# EasyEDA Pro project ProDocument_esp32 brewpiless_2024-01-04.epro

# Schematic esp32 brewpiless

## Sheets
1 ESP32
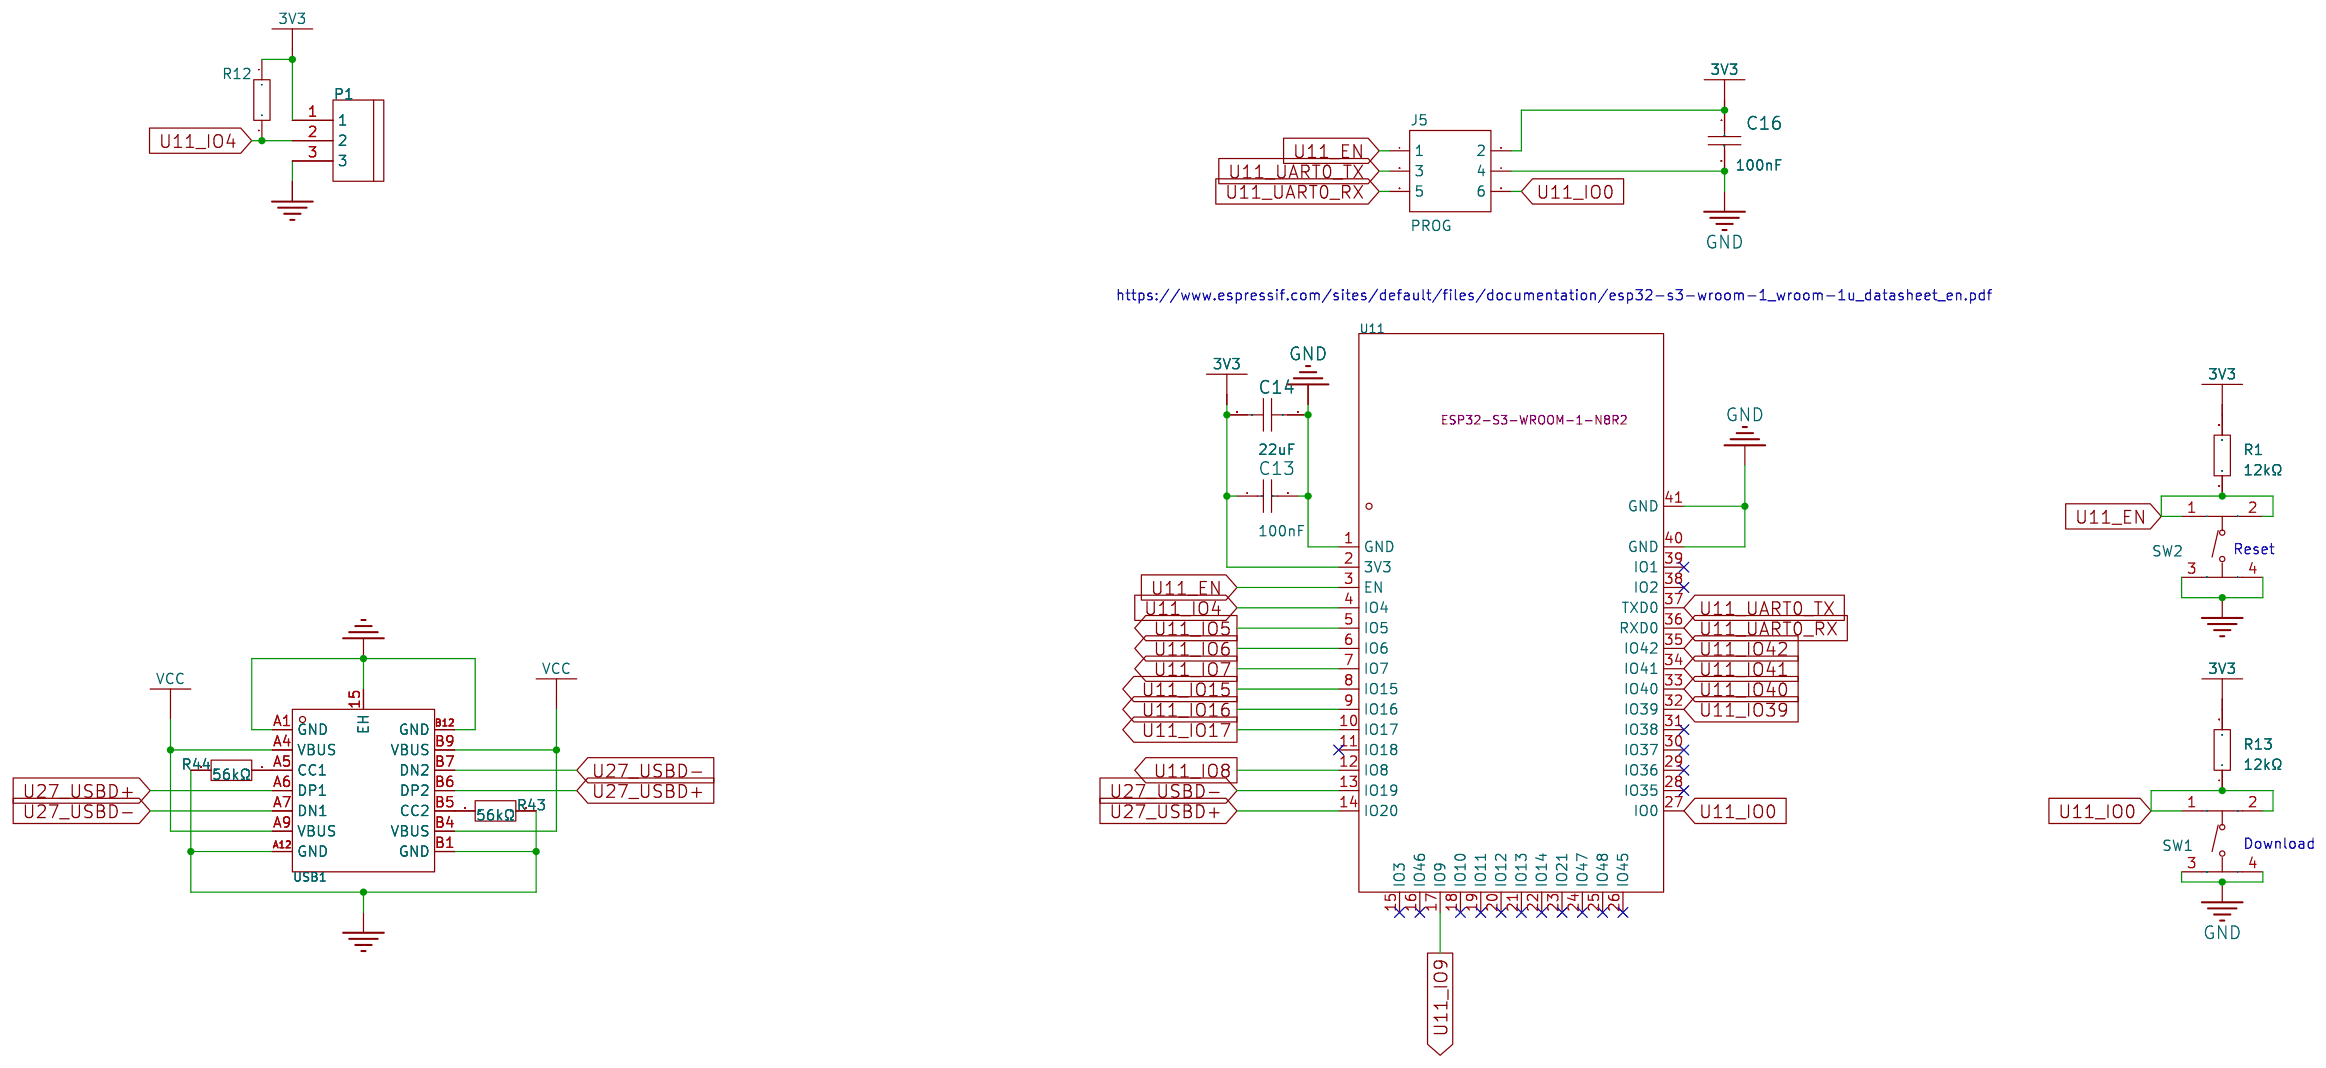
[diagram p0: ESP32]
2 Mains: Create Date: 2023-09-11; Page Name: Mains; Project Name: ESP8266 Brewpiless c6; Schematic Name: ESP32 Brewpiless; Update Date: 2024-01-02; Company: EasyEDA.com; Drawed: EasyEDAPro; Page Size: A4; Part Number: JLCPCB-002; Reviewed: EasyEDAPro; Version: V0.1
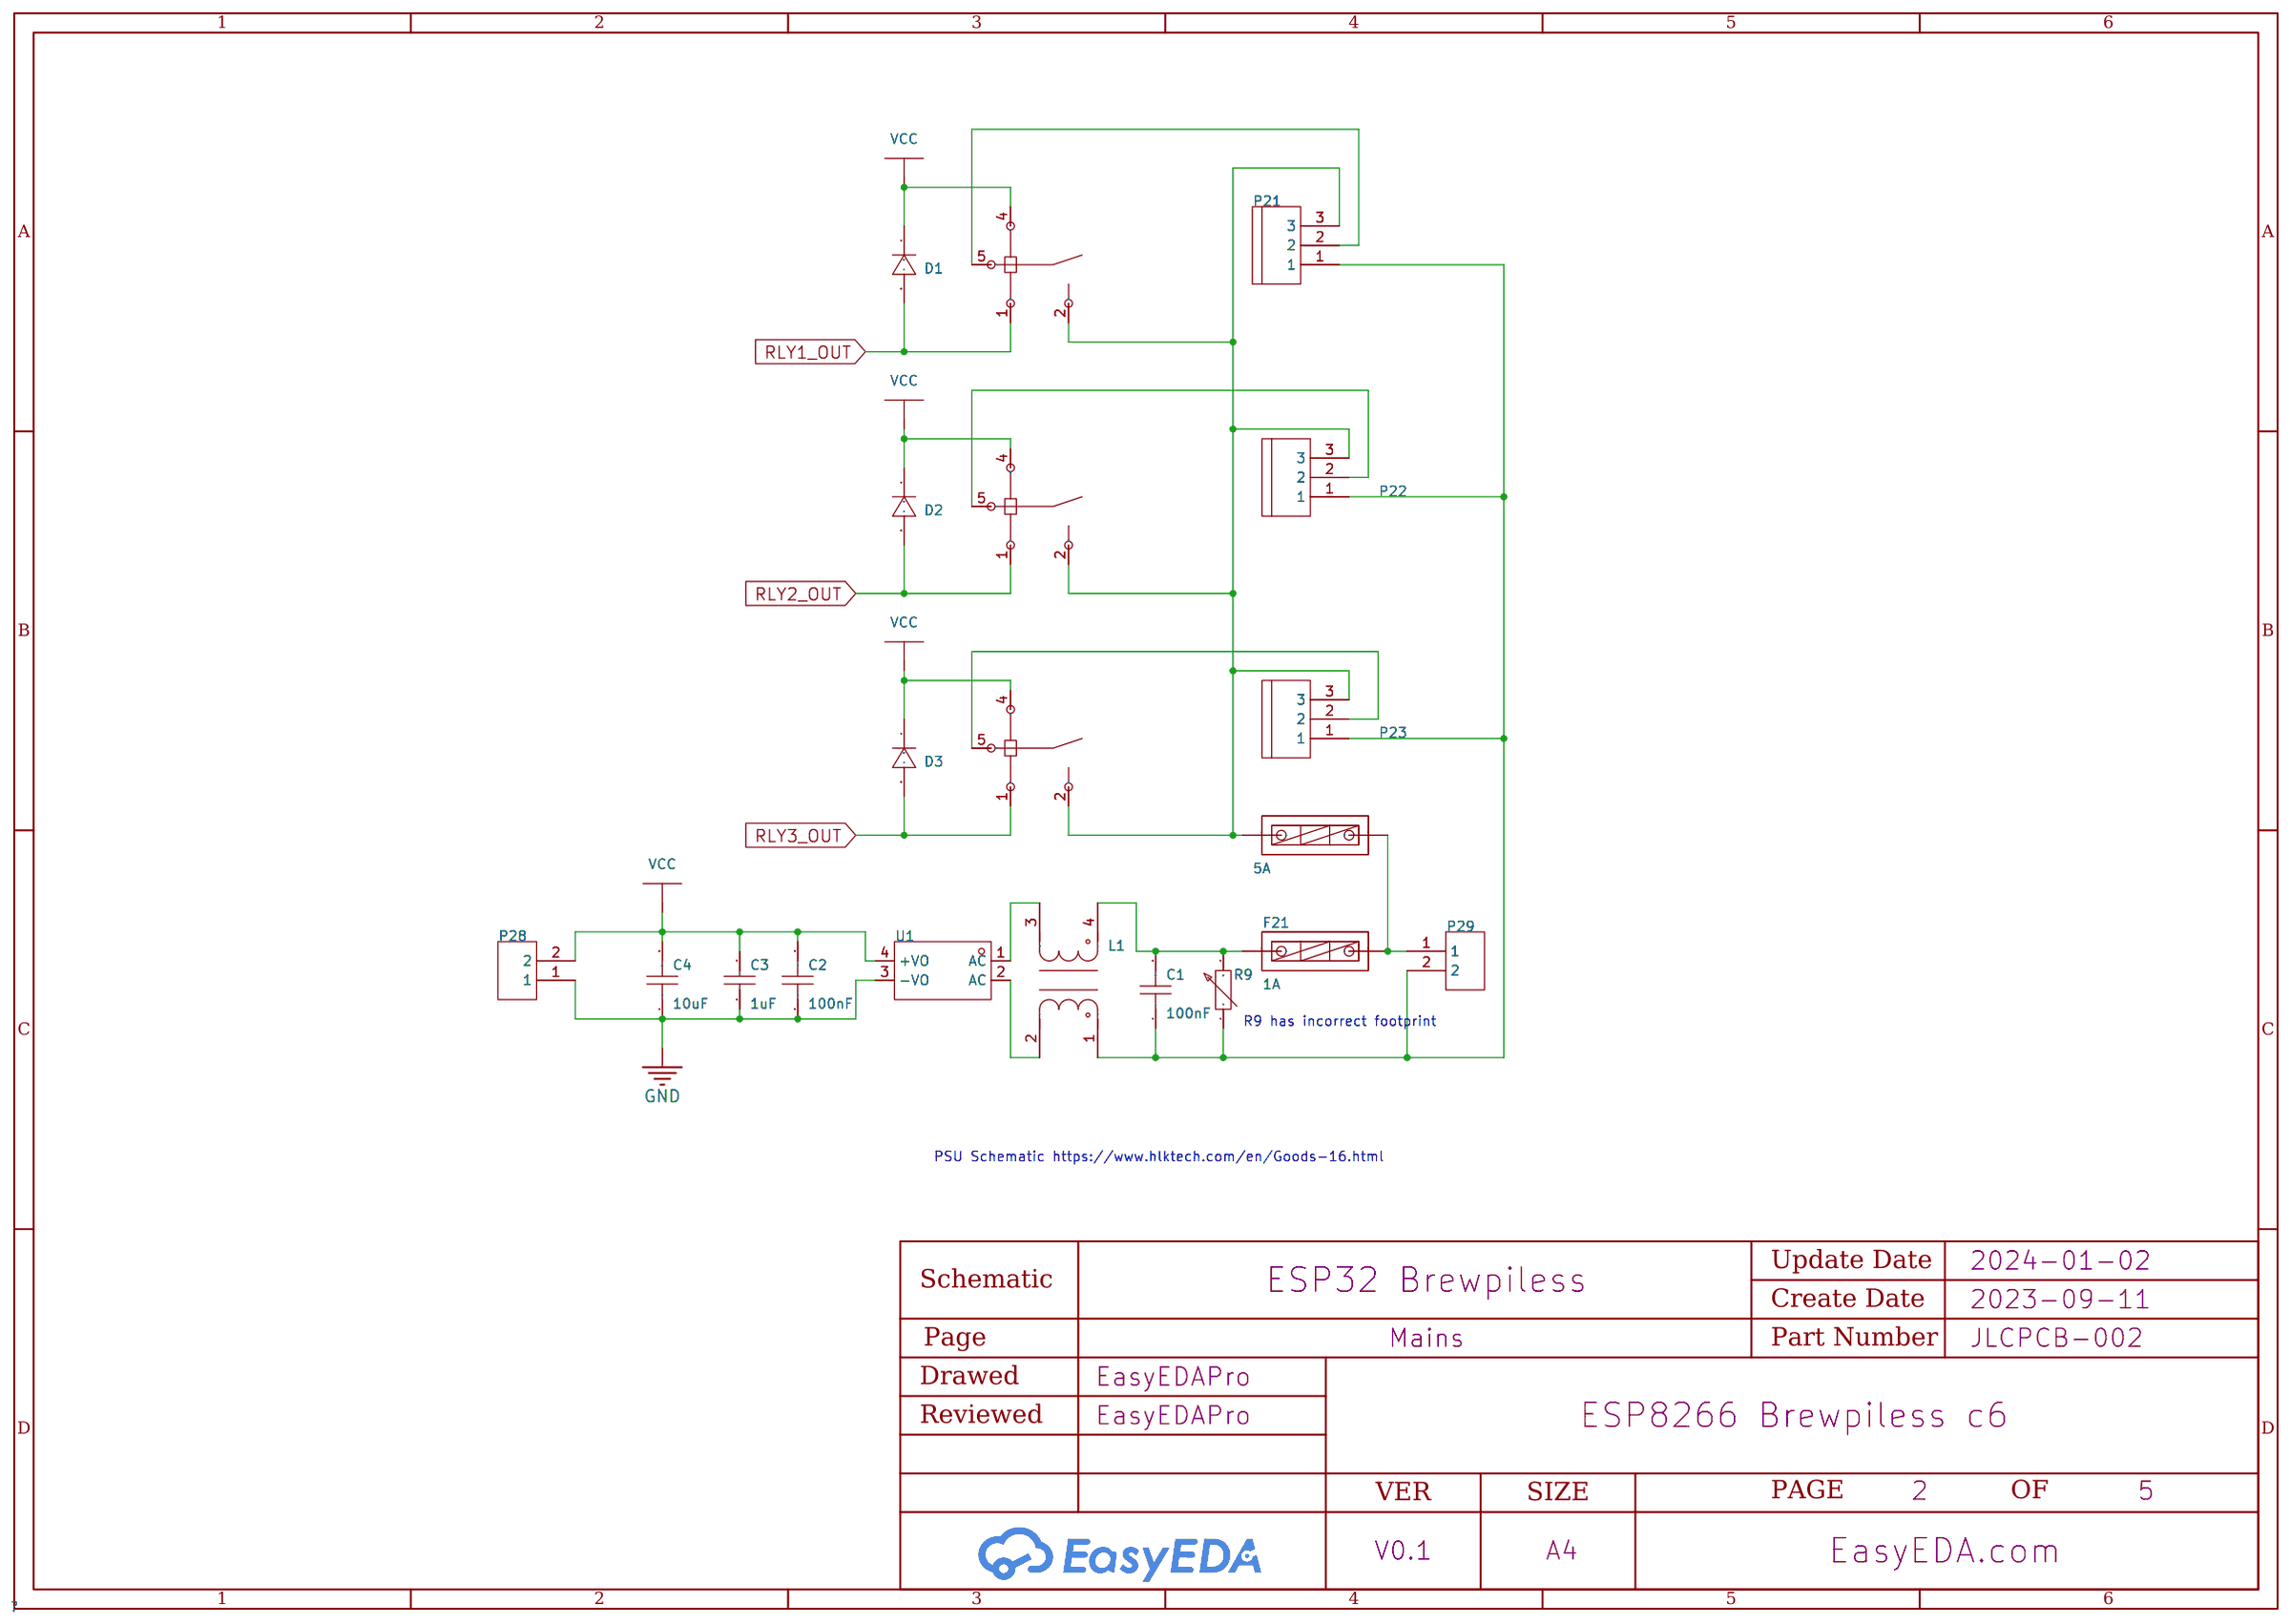
[diagram p1: Mains]
3 LevelShifter: Create Date: 2024-01-03; Page Name: LevelShifter; Project Name: ESP32-S3 Brewpiless V1 Rev 1; Schematic Name: esp32 brewpiless; Update Date: 2024-01-03; Company: EasyEDA.com; Drawed: EasyEDAPro; Page Size: A4; Part Number: JLCPCB-002; Reviewed: EasyEDAPro; Version: V0.1
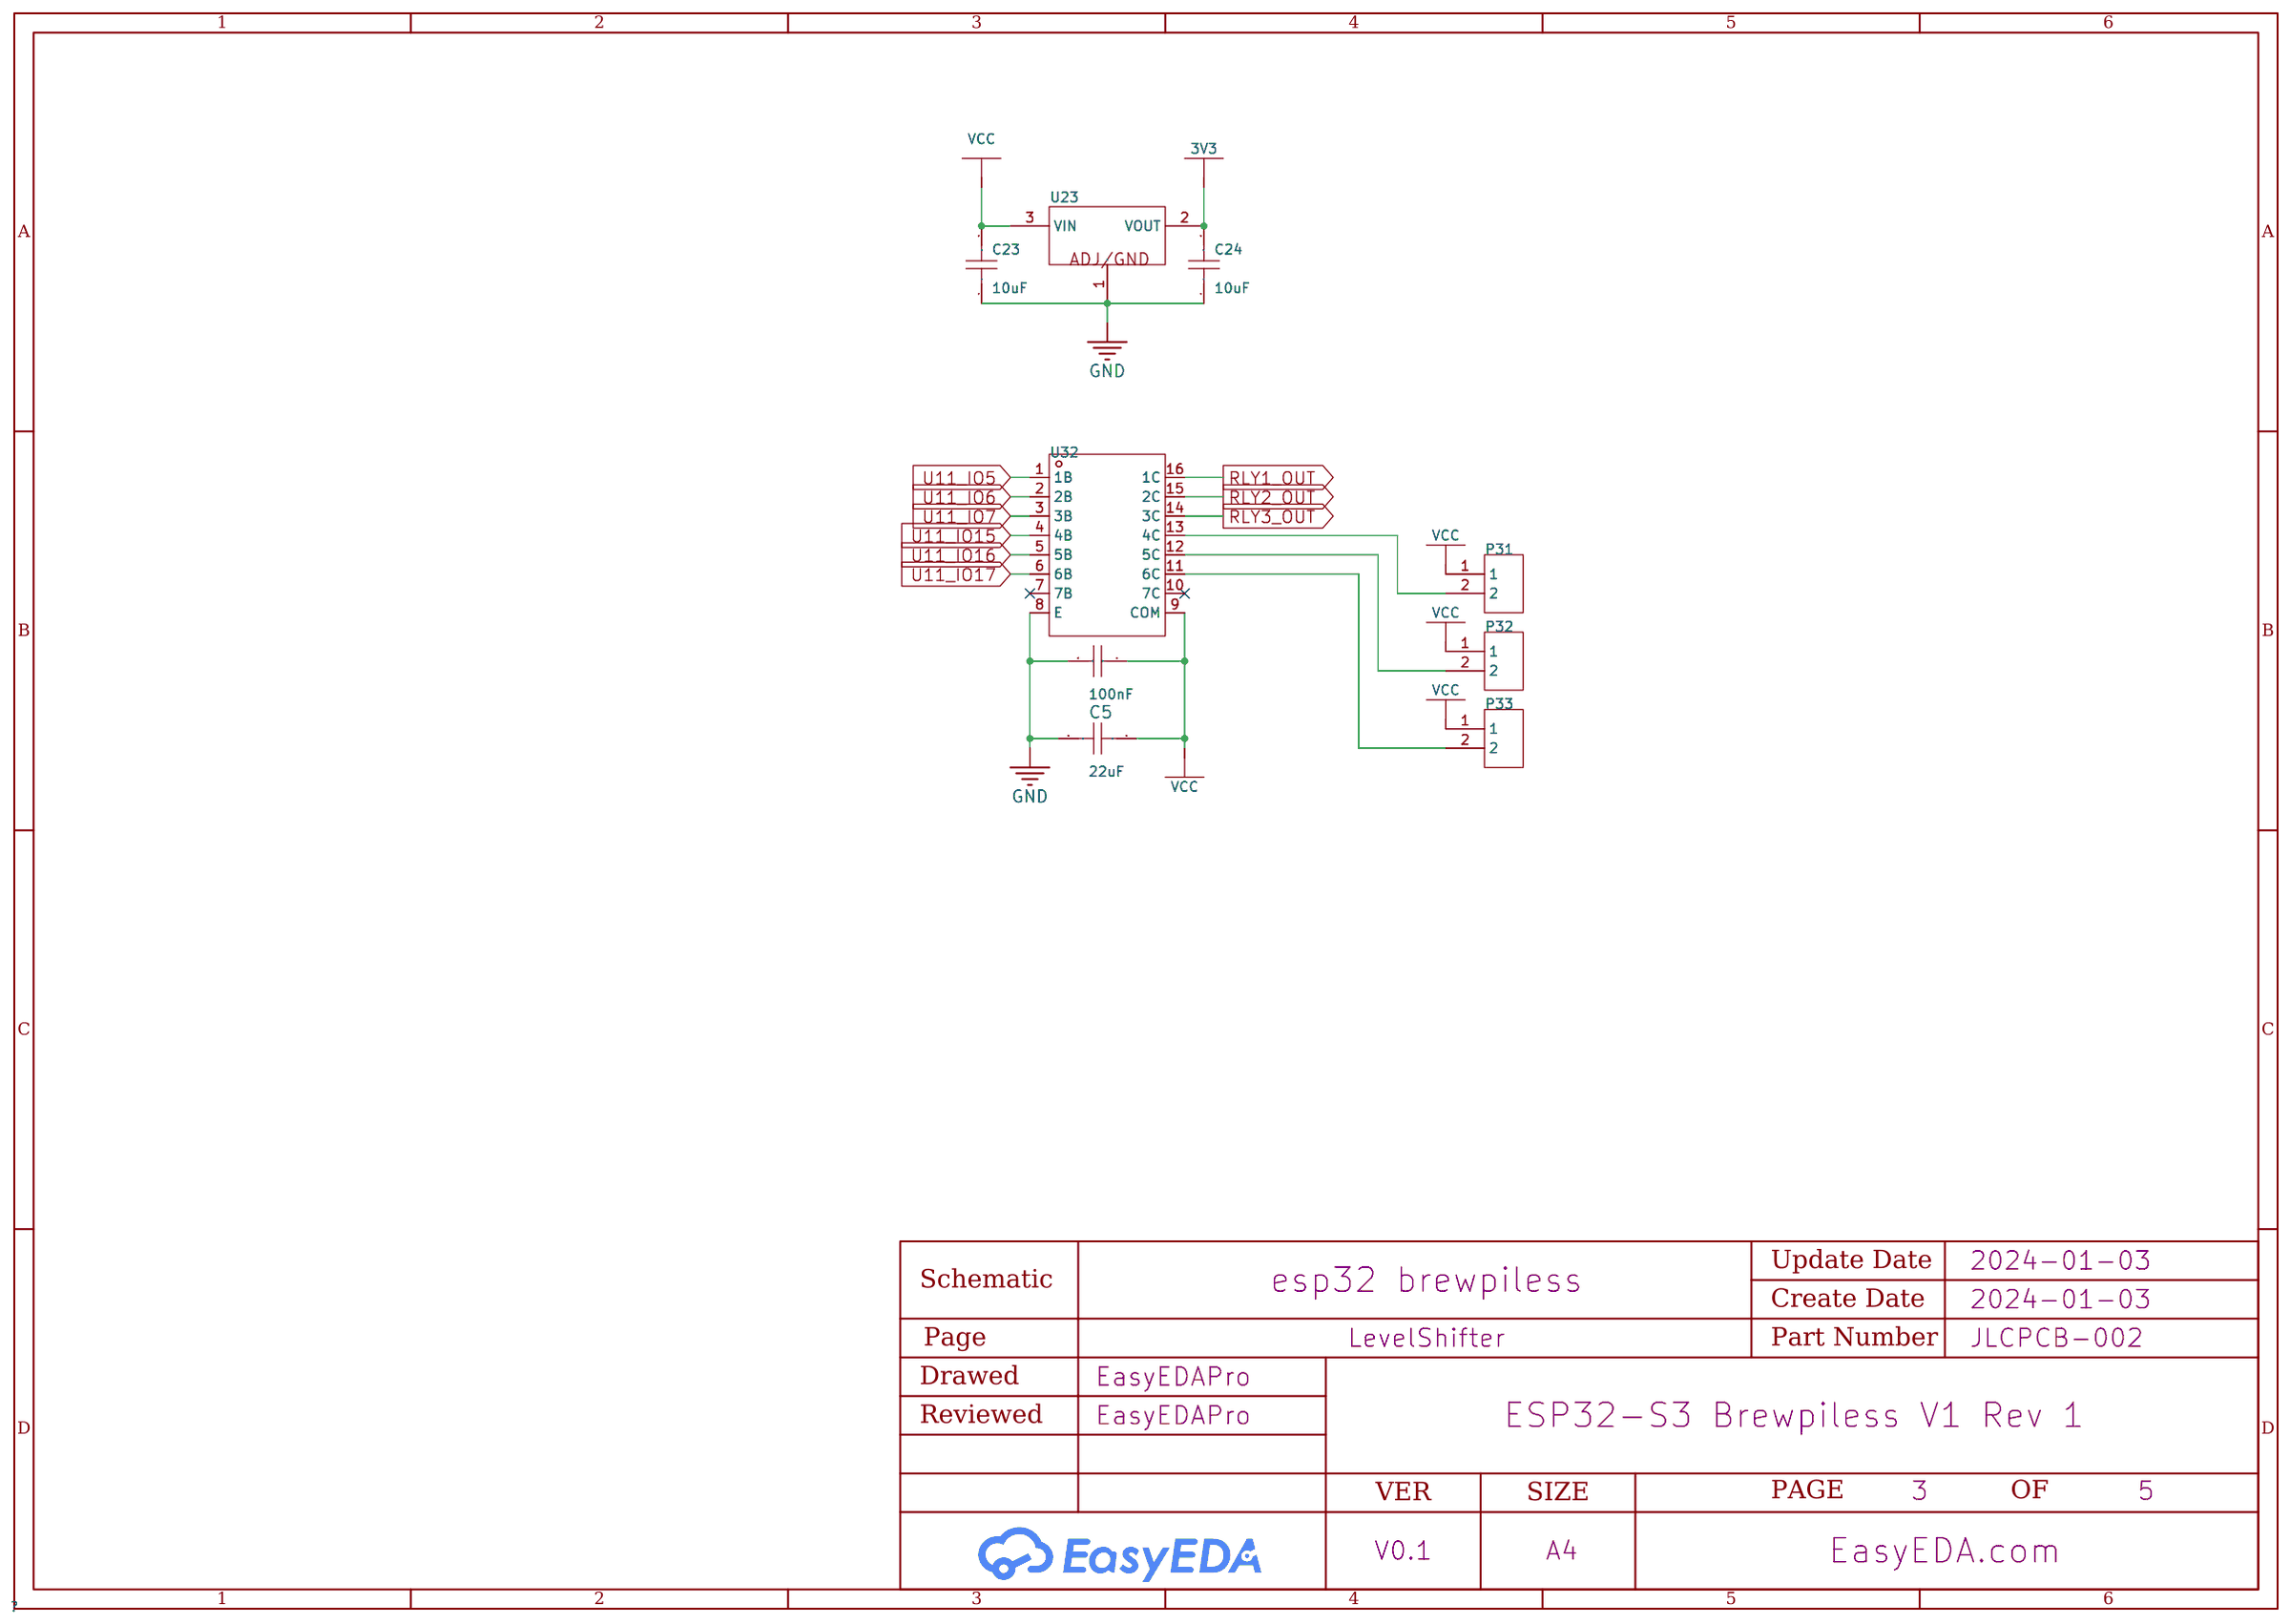
[diagram p2: LevelShifter]
4 RTD: Create Date: 2024-01-01; Page Name: RTD; Project Name: ESP8266 Brewpiless c6; Schematic Name: ESP32 Brewpiless; Update Date: 2024-01-02; Company: EasyEDA.com; Drawed: EasyEDA Pro; Page Size: A4; Part Number: JLCPCB-002; Reviewed: EasyEDA Pro; Version: V0.1
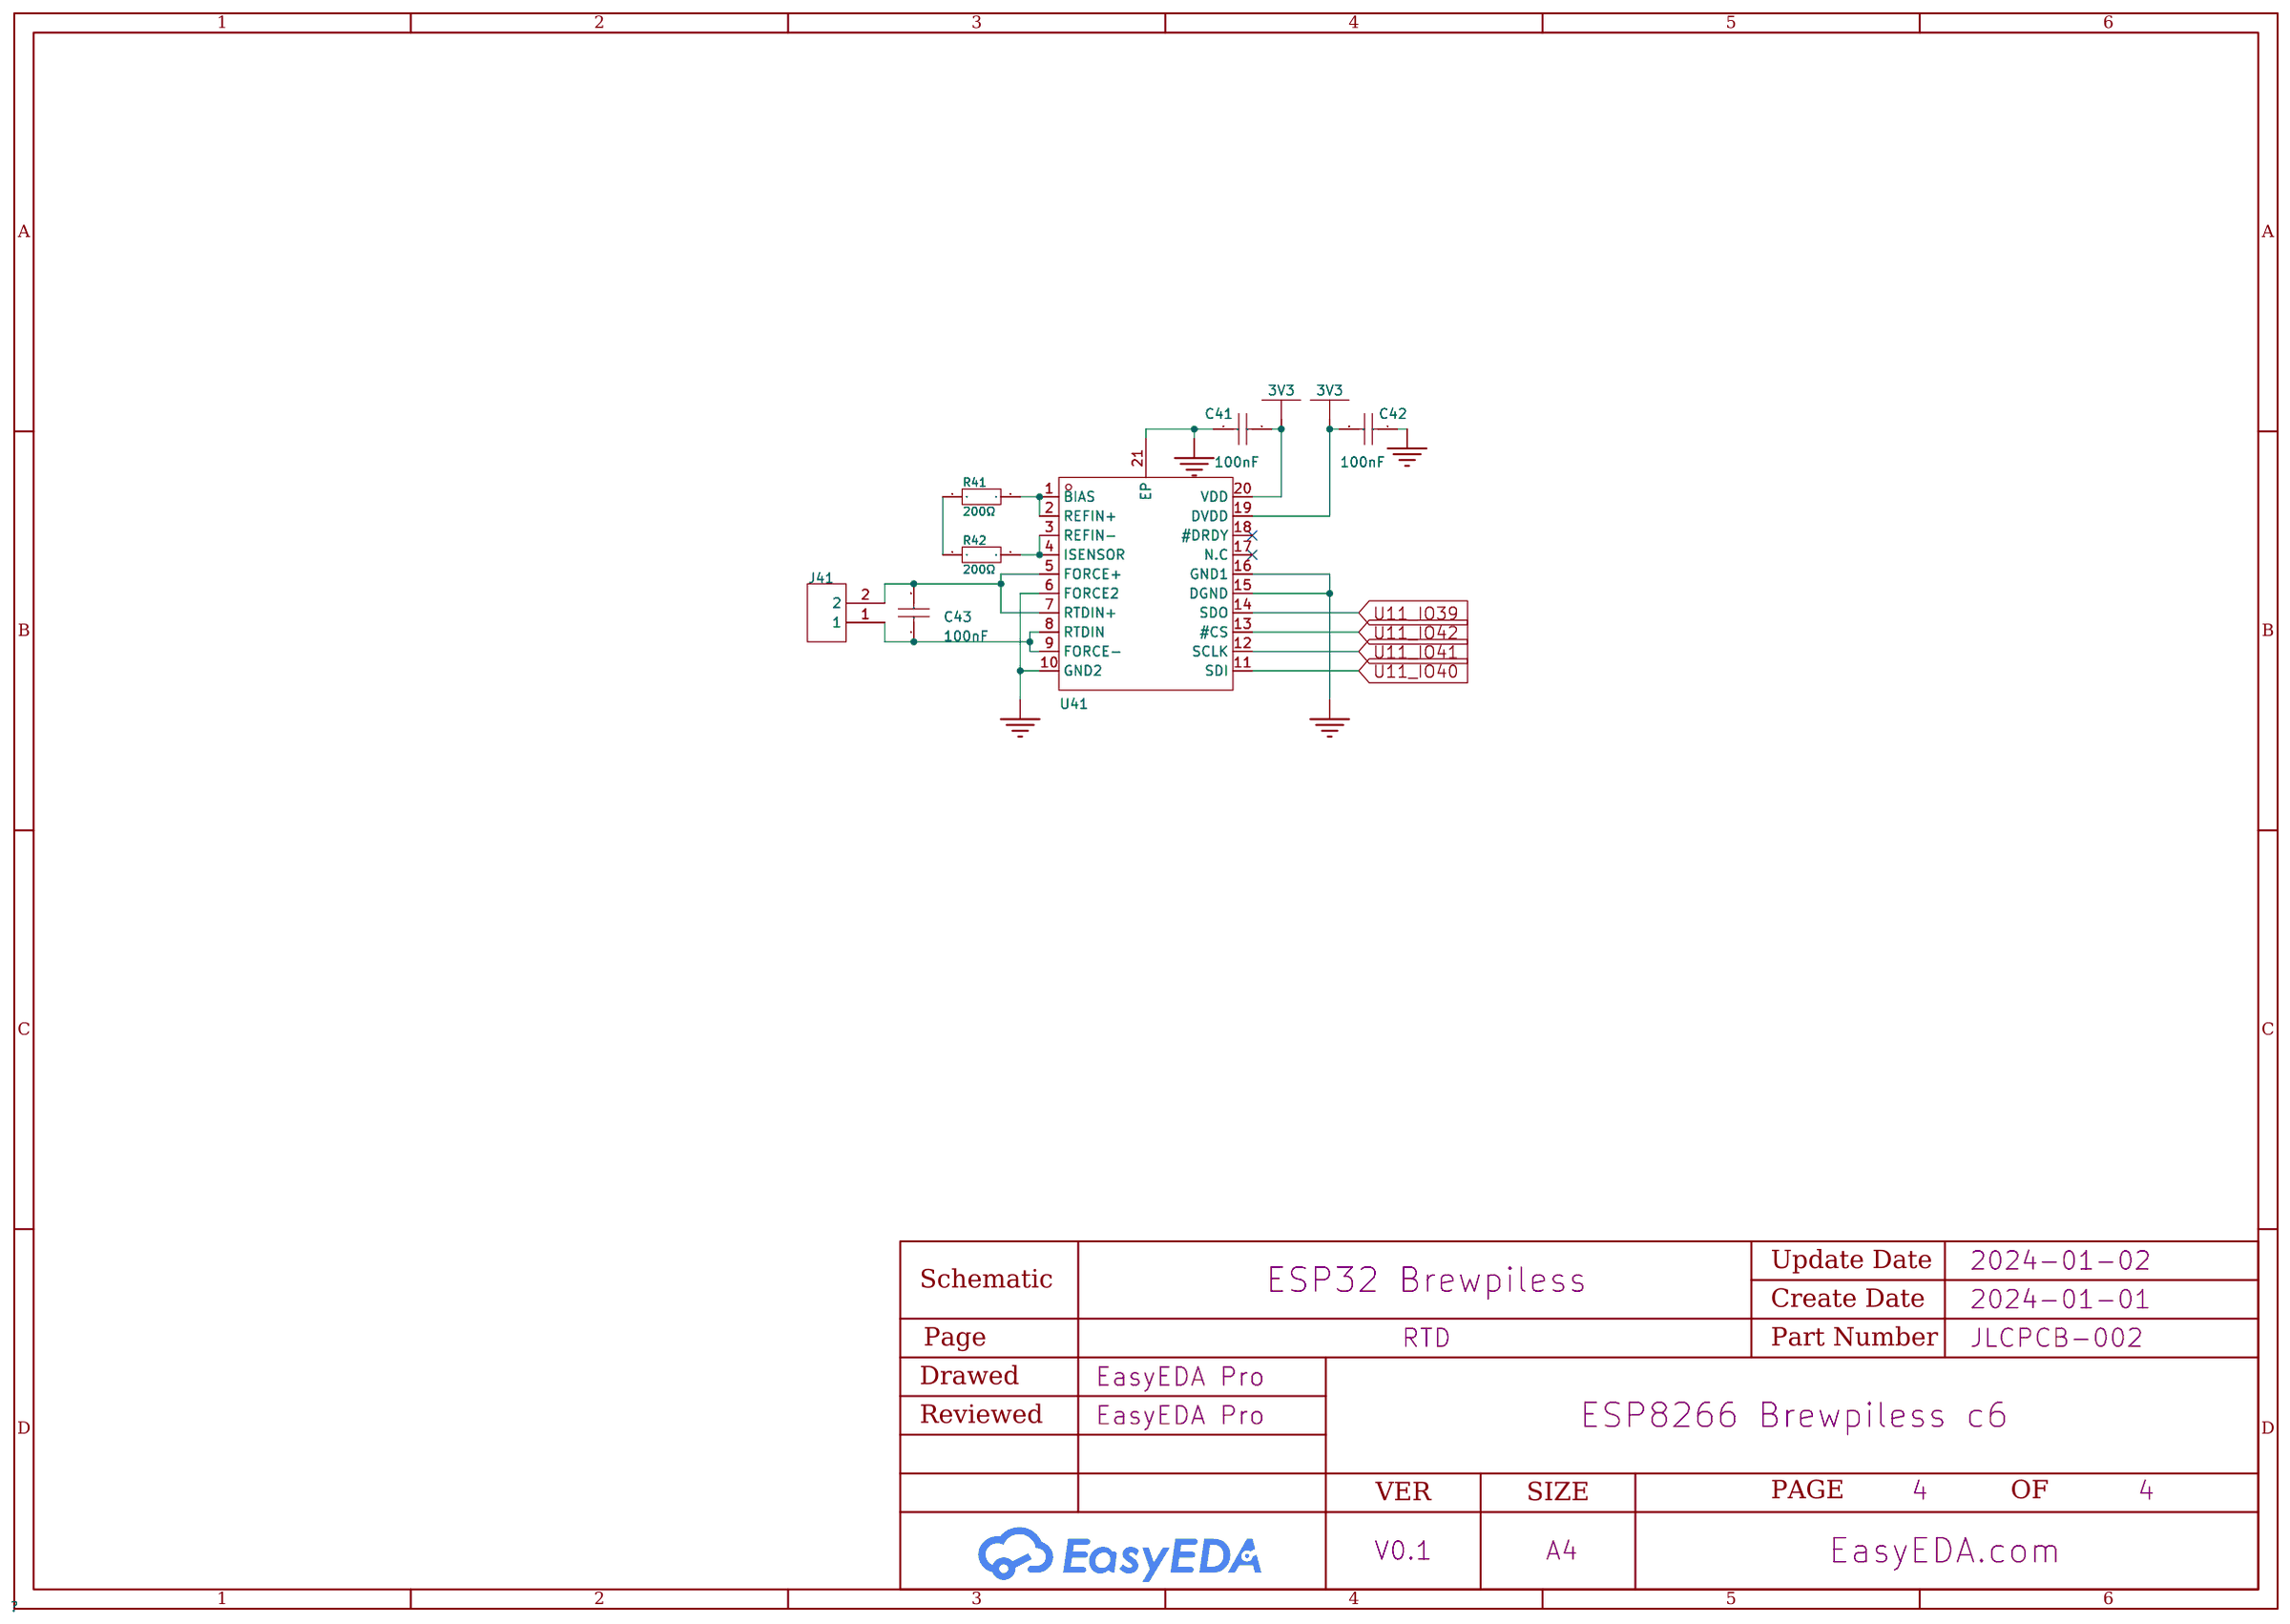
[diagram p3: RTD]
5 ATEC: Create Date: 2024-01-02; Page Name: ATEC; Project Name: ESP8266 Brewpiless c6; Schematic Name: ESP32 Brewpiless; Update Date: 2024-01-02; Company: EasyEDA.com; Drawed: EasyEDA Pro; Page Size: A4; Part Number: JLCPCB-002; Reviewed: EasyEDA Pro; Version: V0.1
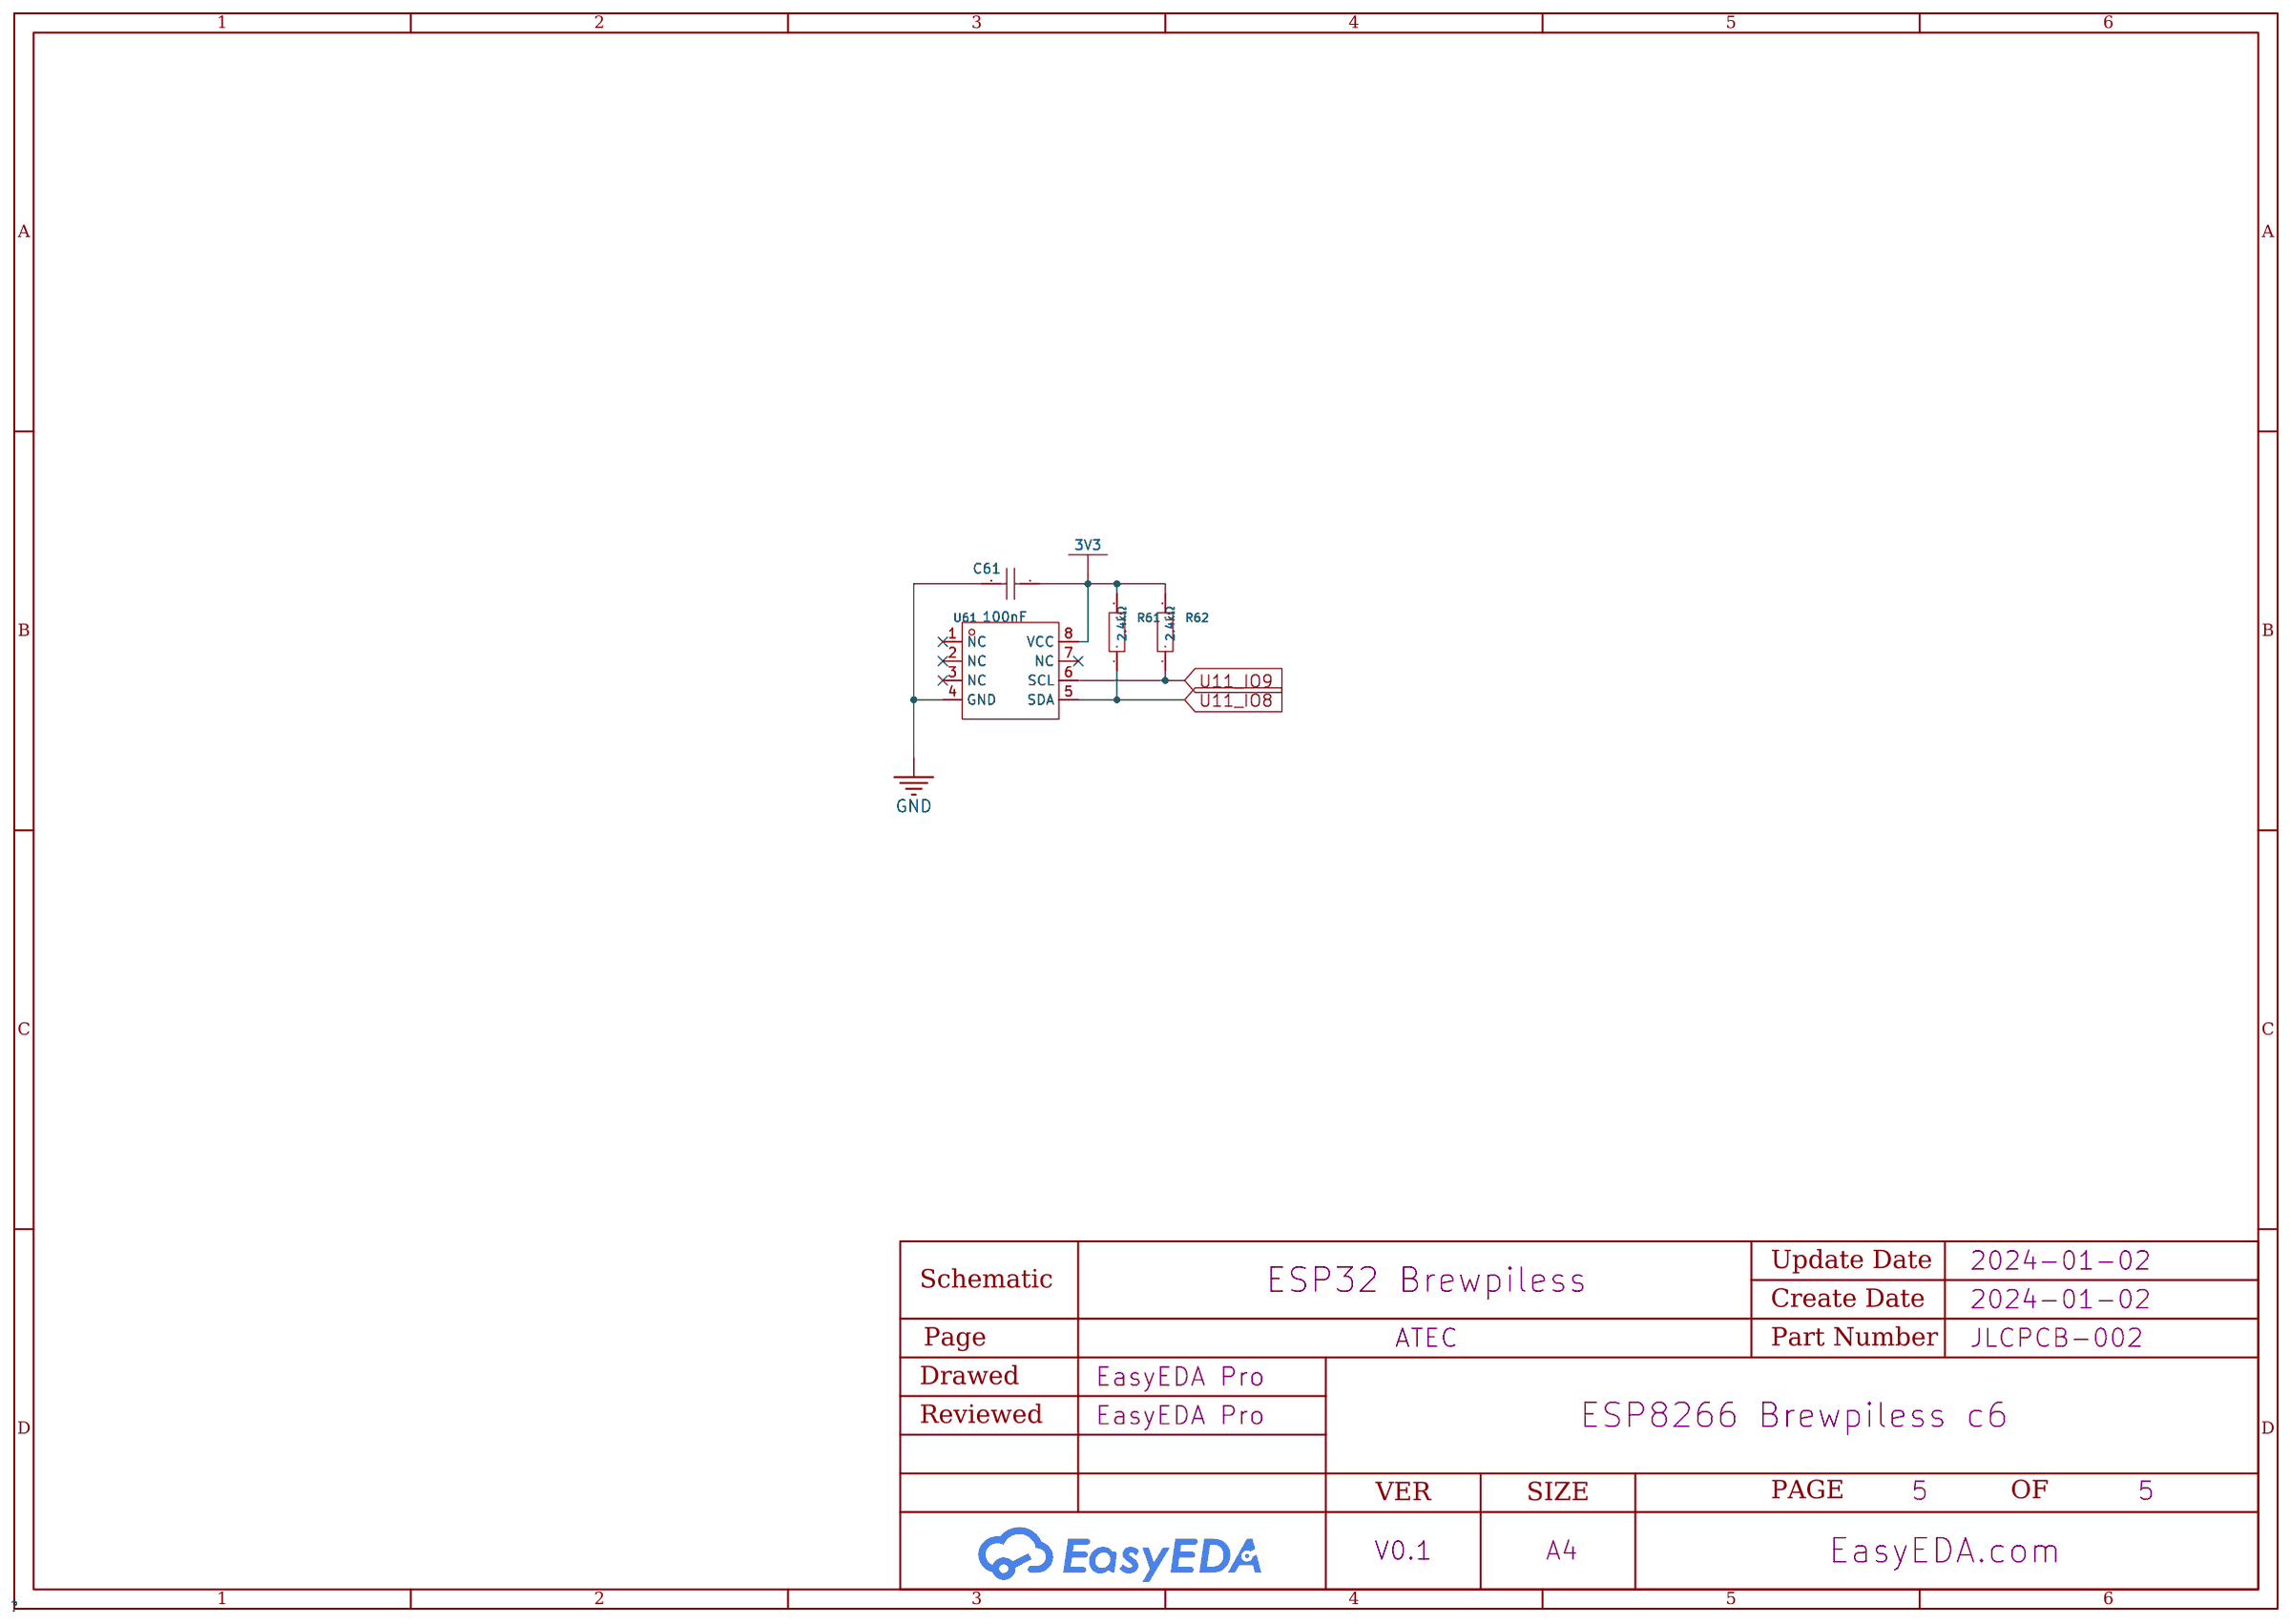
[diagram p4: ATEC]

## Parts
sheet ATEC
C61  100nF  [C0805]
R61  2.4kΩ  [R0805]
R62  2.4kΩ  [R0805]
U61  ATECC608A-SSHDA-T  [SOIC-8_L4.9-W3.9-P1.27-LS6.0-BL]
sheet ESP32
C13  100nF  [C0805]
C14  22uF  [C0805]
C16  100nF  [C0805]
J5  PROG  [IDC-TH_6P-P2.54_C11214]
P1  WJ500V-5.08-3P  [CONN-TH_3P-P5.00_WJ500V-5.08-3P]
R1  12kΩ  [R0805]
R12  4.7kΩ  [R0805]
R13  12kΩ  [R0805]
R43  56kΩ  [R0805]
R44  56kΩ  [R0805]
SW1  TS-1187A-B-A-B  [SW-SMD_4P-L5.1-W5.1-P3.70-LS6.5-TL-2]
SW2  TS-1187A-B-A-B  [SW-SMD_4P-L5.1-W5.1-P3.70-LS6.5-TL-2]
U11  2.4GHz  [WIRELM-SMD_ESP32-S3-WROOM-1]
USB1  TYPE-C 14P LTH10.0  [TYPE-C-SMD_918-468K2029Y50001]
sheet LevelShifter
C5  22uF  [C0805]
C22  100nF  [C0805]
C23  10uF  [C0805]
C24  10uF  [C0805]
P31  WJ500V-5.08-2P  [CONN-TH_2P-P5.00_WJ500V-5.08-2P]
P32  WJ500V-5.08-2P  [CONN-TH_2P-P5.00_WJ500V-5.08-2P]
P33  WJ500V-5.08-2P  [CONN-TH_2P-P5.00_WJ500V-5.08-2P]
U23  -  [TO-252-2_L6.6-W6.1-P4.57-LS9.9-TL-CW]
U32  -  [SOIC-16_L9.9-W3.9-P1.27-LS6.0-BL]
sheet Mains
C1  100nF  [CAP-TH_L12.0-W5.5-P10.00-D0.6]
C2  100nF  [CAP-TH_L12.0-W5.5-P10.00-D0.6]
C3  1uF  [C0805]
C4  10uF  [C0805]
D1  SM4007PL  [SOD-123F_L2.8-W1.8-LS3.7-RD]
D2  SM4007PL  [SOD-123F_L2.8-W1.8-LS3.7-RD]
D3  SM4007PL  [SOD-123F_L2.8-W1.8-LS3.7-RD]
F21  -  [FUSE-TH_5X20RHOSFUSECLIP-SEAT]
F22  5A  [FUSE-TH_5X20RHOSFUSECLIP-SEAT]
F210  1A  [FUSE-TH_5X20RHOSFUSECLIP-SEAT]
F220  10A  [FUSE-TH_5X20RHOSFUSECLIP-SEAT]
K1  -  [RELAY-TH_973-XXVDC-SL-A]
K2  -  [RELAY-TH_973-XXVDC-SL-A]
K3  -  [RELAY-TH_973-XXVDC-SL-A]
L1  -  [FILTER-TH_UU10.5Y-10MH]
P21  WJ500V-5.08-3P  [CONN-TH_3P-P5.00_WJ500V-5.08-3P]
P22  WJ500V-5.08-3P  [CONN-TH_3P-P5.00_WJ500V-5.08-3P]
P23  WJ500V-5.08-3P  [CONN-TH_3P-P5.00_WJ500V-5.08-3P]
P28  WJ500V-5.08-2P  [CONN-TH_2P-P5.00_WJ500V-5.08-2P]
P29  WJ500V-5.08-2P  [CONN-TH_2P-P5.00_WJ500V-5.08-2P]
R9  10D561K  [RES-TH_L13.0-W6.0-P7.50-D0.9-S6.00]
U1  -  [PWRM-TH_HLK-5M05]
sheet RTD
C41  100nF  [C0805]
C42  100nF  [C0805]
C43  100nF  [C0805]
J41  WJ500V-5.08-2P  [CONN-TH_2P-P5.00_WJ500V-5.08-2P]
R41  200Ω  [R0805]
R42  200Ω  [R0805]
U41  MAX31865ATP+T  [QFN-20_L5.0-W5.0-P0.65-BL-EP]

## Library data of the parts
C41-C43 C61 = CC0805KRX7R9BB104: Capacitance: Tolerance:±10% Tolerance:±10% Voltage Rated: Temperature Coefficient:; LCSC Part Name: 100nF ±10% 50V; Supplier Part: C49678; Manufacturer: YAGEO(国巨); Supplier Footprint: 0805; JLCPCB Part Class: Basic Part; Datasheet: https://atta.szlcsc.com/upload/public/pdf/source/20180224/C181747_15194369449651363981.pdf; Supplier: LCSC; Tolerance: ±10%; Voltage Rated: 450V; Operating Temperature: -40℃~+105℃
R61 R62 = 0805W8F2401T5E: Resistance:2400Ω Tolerance:±1% Tolerance:±1% Power(Watts): Overload Voltage (Max): Temperature Coefficient:±100ppm/℃ Temperature Coefficient:±100ppm/℃ Type:Thick Film Resistors Operating Temperature Range:-55℃~+155℃ Operating Temperature Range:-55℃~+155℃; LCSC Part Name: 2.4kΩ ±1% 125mW 厚膜电阻; Supplier Part: C17526; Manufacturer: UNI-ROYAL(厚声); Supplier Footprint: 0805; JLCPCB Part Class: Basic Part; Datasheet: https://atta.szlcsc.com/upload/public/pdf/source/20200306/C422600_1E6D84923E4A46A82E41ADD87F860B5C.pdf; Supplier: LCSC; Tolerance: ±1%; Temperature Coefficient: ±100ppm/℃; Type: Thick Film Resistors; Operating Temperature Range: -55℃~+155℃
U61 = ATECC608A-SSHDA-T_C616024: Supplier Part: C616024; Manufacturer: MICROCHIP(美国微芯); Supplier Footprint: SOP-8; JLCPCB Part Class: Extended Part; Datasheet: https://atta.szlcsc.com/upload/public/pdf/source/20211006/C2650407_D58AC76DEF233DF217701720610C6837.pdf; Supplier: LCSC
C13 C16 C22 = CC0805KRX7R9BB104: Capacitance: Tolerance:±10% Tolerance:±10% Voltage Rated: Temperature Coefficient:; LCSC Part Name: 100nF ±10% 50V; Supplier Part: C49678; Manufacturer: YAGEO(国巨); Supplier Footprint: 0805; JLCPCB Part Class: Basic Part; Datasheet: https://atta.szlcsc.com/upload/public/pdf/source/20180224/C181747_15194369449651363981.pdf; Supplier: LCSC; Tolerance: ±10%; Voltage Rated: 50V; Temperature Coefficient: X7R
C5 C14 = CL21A226MAQNNNE_C45783: Capacitance: Tolerance:±20% Tolerance:±20% Voltage Rated: Temperature Coefficient:; LCSC Part Name: 22uF ±20% 25V; Supplier Part: C45783; Manufacturer: SAMSUNG(三星); Manufacturer Part: CL21A226MAQNNNE; Supplier Footprint: 0805; JLCPCB Part Class: Basic Part; Datasheet: https://atta.szlcsc.com/upload/public/pdf/source/20160218/1457707763339.pdf; Supplier: LCSC; Tolerance: ±20%; Voltage Rated: 50V; Temperature Coefficient: Y5V
J5 = 2.54-2*3P简牛: Connector Type:简牛座 Pitch:2.54mm Number of Rows:2 Row Spacing:2.54mm Holder Type:直插 Contact Material:黄铜 Contact Plating:金; LCSC Part Name: 2.54mm 排数:2 2*3P; Supplier Part: C11214; Manufacturer: BOOMELE(博穆精密); Supplier Footprint: 插件,P=2.54mm; JLCPCB Part Class: Extended Part; Datasheet: https://atta.szlcsc.com/upload/public/pdf/source/20140331/1457707037652.pdf; Supplier: LCSC; Connector Type: 简牛座; Pitch: 2.54mm; Number of Rows: 2; Row Spacing: 2.54mm; Holder Type: 直插; Contact Material: 黄铜; Contact Plating: 金
P1 = WJ500V-5.08-3P: Pitch:5.08mm Structure:1x3P Number of Rows:1 Number of PINs Per Row:3 Mounting Style:Straight Current Rating (Max):18A Voltage Rating (Max):250V Wire Gauge - AWG:14~30 Wire Gauge - AWG:14~30 Wire Gauge - mm2:2.5 Wire Gauge - mm2:2.5 Operating Temperature; LCSC Part Name: 5.08mm 1x3P 排数:1 每排P数:3 直插 可拼接; Supplier Part: C72334; Manufacturer: KANGNEX(康奈克斯电气); Supplier Footprint: 插件,P=5.08mm; JLCPCB Part Class: Extended Part; Datasheet: https://atta.szlcsc.com/upload/public/pdf/source/20191225/C72334_8A5EF831D67650233B6B1E3F2BC06274.pdf; Supplier: LCSC; Pitch: 5.08mm; Structure: 1x3P; Number of Rows: 1; Number of PINs Per Row: 3; Mounting Style: Straight; Current Rating (Max): 18A; Voltage Rating (Max): 250V; Wire Gauge - AWG: 14~30; Wire Gauge - mm2: 2.5; Operating Temperature Range: -40℃~+105℃; Color: Green; Number of Pins: 3P; Wire Gauge - mm?: 2.5
R1 R13 = 0805W8F1202T5E: Resistance:12000Ω Tolerance:±1% Tolerance:±1% Power(Watts): Overload Voltage (Max): Temperature Coefficient:±100ppm/℃ Temperature Coefficient:±100ppm/℃ Type:Thick Film Resistors Operating Temperature Range:-55℃~+155℃ Operating Temperature Range:-55℃~+155℃; LCSC Part Name: 12kΩ ±1% 125mW 厚膜电阻; Supplier Part: C17444; Manufacturer: UNI-ROYAL(厚声); Supplier Footprint: 0805; JLCPCB Part Class: Basic Part; Datasheet: https://atta.szlcsc.com/upload/public/pdf/source/20200306/C422600_1E6D84923E4A46A82E41ADD87F860B5C.pdf; Supplier: LCSC; Tolerance: ±1%; Power(Watts): 1/3W; Overload Voltage (Max): 150V; Temperature Coefficient: ±100ppm/℃; Type: Thick Film Resistors; Operating Temperature Range: -55℃~+155℃
R12 = 0805W8F4701T5E: Resistance:4700Ω Tolerance:±1% Tolerance:±1% Power(Watts): Overload Voltage (Max): Temperature Coefficient:±100ppm/℃ Temperature Coefficient:±100ppm/℃ Type:Thick Film Resistors Operating Temperature Range:-55℃~+155℃ Operating Temperature Range:-55℃~+155℃; LCSC Part Name: 4.7kΩ ±1% 125mW 厚膜电阻; Supplier Part: C17673; Manufacturer: UNI-ROYAL(厚声); Supplier Footprint: 0805; JLCPCB Part Class: Basic Part; Datasheet: https://atta.szlcsc.com/upload/public/pdf/source/20200306/C422600_1E6D84923E4A46A82E41ADD87F860B5C.pdf; Supplier: LCSC; Tolerance: ±1%; Power(Watts): 125mW; Overload Voltage (Max): 150V; Temperature Coefficient: ±100ppm/℃; Type: Thick Film Resistors; Operating Temperature Range: -55℃~+155℃
R43 R44 = ARG05DTC5602: Type:Thin Film Resistor Resistance: Tolerance:±0.5% Tolerance:±0.5% Power(Watts): Temperature Coefficient:±25ppm/℃ Temperature Coefficient:±25ppm/℃ Overload Voltage (Max): Operating Temperature Range:-55℃~+155℃ Operating Temperature Range:-55℃~+155℃; LCSC Part Name: 56kΩ ±0.5% 125mW; Supplier Part: C2828780; Manufacturer: Viking(光颉); Supplier Footprint: 0805; JLCPCB Part Class: Extended Part; Datasheet: https://atta.szlcsc.com/upload/public/pdf/source/20210426/C2828737_35D2DDB0BDDA00747C2712435E28BBD4.pdf; Supplier: LCSC; Type: Thin Film Resistor; Tolerance: ±0.5%; Temperature Coefficient: ±25ppm/℃; Operating Temperature Range: -55℃~+155℃
SW1 SW2 = TS-1187A-B-A-B: Contact Current:50mA Voltage Rating (DC):12V Insulation Resistance:- Circuit:SPST Mounting Style:Brick nogging Actuator Style:Round Button Actuator/Cap Color:金色 With Lamp:No Operating Force:160gf Mechanical Life:100000次 Operating Temperature:-30℃~+85℃ Ope; LCSC Part Name: 5.1*5.1*1.5mm 立贴 轻触开关 防水金属头; Supplier Part: C318884; Manufacturer: XKB Connectivity(中国星坤); Supplier Footprint: SMD; JLCPCB Part Class: Basic Part; Datasheet: https://atta.szlcsc.com/upload/public/pdf/source/20200227/C318884_1F20165719E1C4CAA3E10C4C359C6E26.pdf; Supplier: LCSC; Contact Current: 50mA; Voltage Rating (DC): 12V; Circuit: SPST; Mounting Style: Brick nogging; Actuator Style: Round Button; Actuator/Cap Color: 金色; With Lamp: No; Operating Force: 160gf; Mechanical Life: 100000次; Operating Temperature: -30℃~+85℃; Switch Length: 5.1mm; Switch Width: 5.1mm; Switch Height: 1.5mm; Strike Gundam: NO; Pin Style: SMD接片
U11 = ESP32-S3-WROOM-1-N8R2: Core Processor:ESP32-S3芯片 Support Interface:I2C；GPIO；SPI；PWM；ADC；UART；USB；I2S Frequency:2.4GHz; LCSC Part Name: 通用型Wi-Fi+低功耗蓝牙MCU模组; Supplier Part: C2913204; Manufacturer: ESPRESSIF(乐鑫); Supplier Footprint: SMD,18x25.5mm; JLCPCB Part Class: Extended Part; Datasheet: https://atta.szlcsc.com/upload/public/pdf/source/20220628/A2AC12B3C87735CAEB7EBE2DBE80936C.pdf; Supplier: LCSC; Core Processor: ESP32-S3芯片; Support Interface: I2C；GPIO；SPI；PWM；ADC；UART；USB；I2S
USB1 = TYPE-C 14P LTH10.0: Connector Type:Type-C Gender:Female Number of Contacts:14P Number of Ports:1 Mounting Style:Brick nogging Current Rating - Power (Max):5A Operating Temperature Range:-40℃~+85℃ Operating Temperature Range:-40℃~+85℃; LCSC Part Name: Type-C 母 立贴; Supplier Part: C5187467; Manufacturer: SHOU HAN(首韩); Supplier Footprint: SMD; JLCPCB Part Class: Extended Part; Datasheet: https://atta.szlcsc.com/upload/public/pdf/source/20220929/372BD15DA7BF2B0C3EB7CA3B355D320D.pdf; Supplier: LCSC; Connector Type: Type-C; Gender: Female; Number of Contacts: 14P; Number of Ports: 1; Mounting Style: Brick nogging; Current Rating - Power (Max): 5A; Operating Temperature Range: -40℃~+85℃
C4 C23 C24 = GRM21BR61H106KE43L: Capacitance: Tolerance:±10% Tolerance:±10% Voltage Rated: Temperature Coefficient:; LCSC Part Name: 10uF ±10% 50V; Supplier Part: C440198; Manufacturer: muRata(村田); Supplier Footprint: 0805; JLCPCB Part Class: Basic Part; Datasheet: https://atta.szlcsc.com/upload/public/pdf/source/20230811/95AAE0C9AF55EDC31B7A4D8B733F534E.pdf; Supplier: LCSC; Tolerance: ±10%; Voltage Rated: 16V; Temperature Coefficient: X5R
J41 P28 P29 P31-P33 = WJ500V-5.08-2P: Pitch:5.08mm Structure:1x2P Number of Rows:1 Number of PINs Per Row:2 Mounting Style:Straight Current Rating (Max):18A Voltage Rating (Max):250V Wire Gauge - AWG:14~30 Wire Gauge - AWG:14~30 Wire Gauge - mm2:2.5 Wire Gauge - mm2:2.5 Operating Temperature; LCSC Part Name: 5.08mm 1x2P 排数:1 每排P数:2 直插 可拼接; Supplier Part: C8465; Manufacturer: KANGNEX(康奈克斯电气); Supplier Footprint: 插件,P=5.08mm; JLCPCB Part Class: Extended Part; Datasheet: https://atta.szlcsc.com/upload/public/pdf/source/20191225/C8465_02D34CE5B5B4A53DF5891601D97FA9F4.pdf; Supplier: LCSC; Pitch: 5.08mm; Structure: 1x2P; Number of Rows: 1; Number of PINs Per Row: 2; Mounting Style: Straight; Current Rating (Max): 18A; Voltage Rating (Max): 250V; Wire Gauge - AWG: 14~30; Wire Gauge - mm2: 2.5; Operating Temperature Range: -40℃~+105℃; Color: Green; Number of Pins: 2P; Wire Gauge - mm?: 1.5
U23 = LM1117RS-3.3: OutputType:固定OutputPolarity:正NumberofOutputs:1MaximumInputVoltage:12VOutputVoltage:3.3VOutputVoltage:3.3VDropoutVoltage:1.3V@(1A)OutputCurrent:1APowerSupplyRejectionRatio(PRSS):75dB@(120Hz); LCSC Part Name: Vin=12VVout=3.3V1A75dB@(120Hz); Supplier Part: C126023; Manufacturer: HTC; Supplier Footprint: TO-252-2(DPAK); JLCPCB Part Class: ExtendedPart; Datasheet: https://atta.szlcsc.com/upload/public/pdf/source/20170814/C126023_1502678372096885895.pdf; Supplier: LCSC; Output Type: 固定; Output Polarity: 正; Number of Outputs: 1; Maximum Input Voltage: 12V; Output Voltage: 3.3V; Dropout Voltage: 1.3V@(1A); Output Current: 1A; Power Supply Rejection Ratio (PRSS): 75dB@(120Hz)
U32 = ULN2003ADR: Supplier Part: C7512; Manufacturer: TI(德州仪器); Supplier Footprint: SOIC-16_150mil; JLCPCB Part Class: BasicPart; Datasheet: https://atta.szlcsc.com/upload/public/pdf/source/20140704/1457707116045.pdf; Supplier: LCSC
C1 = MPP104J2W10AJ22620: Capacitance:100nF Tolerance:±5% Tolerance:±5% Voltage Rated:450V Operating Temperature:-40~+105 Operating Temperature:-40~+105; LCSC Part Name: 100nF±5%450VCBB22(MPP)金属化聚丙烯膜电容器; Supplier Part: C506846; Manufacturer: KNSCHA(科尼盛); Supplier Footprint: 径向引线,P=10mm; JLCPCB Part Class: ExtendedPart; Datasheet: https://atta.szlcsc.com/upload/public/pdf/source/20200331/C506846_A55F5C13A66FE116FD53E25D5158208D.pdf; Supplier: LCSC; Tolerance: ±5%; Voltage Rated: 450V; Operating Temperature: -40~+105
C2 = MPP104J2W10AJ22620: Capacitance: Tolerance:±5% Tolerance:±5% Voltage Rated: Operating Temperature:-40℃~+105℃ Operating Temperature:-40℃~+105℃; LCSC Part Name: 100nF ±5% 450V; Supplier Part: C506846; Manufacturer: KNSCHA(科尼盛); Supplier Footprint: 插件,P=10mm; JLCPCB Part Class: Extended Part; Datasheet: https://atta.szlcsc.com/upload/public/pdf/source/20200331/C506846_A55F5C13A66FE116FD53E25D5158208D.pdf; Supplier: LCSC; Tolerance: ±5%; Voltage Rated: 450V; Operating Temperature: -40℃~+105℃
C3 = CL21B105KBFNNNE: Capacitance: Tolerance:±10% Tolerance:±10% Voltage Rated: Temperature Coefficient:; LCSC Part Name: 1uF ±10% 50V; Supplier Part: C28323; Manufacturer: SAMSUNG(三星); Supplier Footprint: 0805; JLCPCB Part Class: Basic Part; Datasheet: https://atta.szlcsc.com/upload/public/pdf/source/20160218/1457707763339.pdf; Supplier: LCSC; Tolerance: ±10%; Voltage Rated: 50V; Temperature Coefficient: Y5V
D1-D3 = SM4007PL_C64898: Diode Configuration: Forward Voltage (Vf@If):1.1V@1A Reverse Voltage (Vr): Average Rectified Current (Io): Reverse Leakage Current:10uA@1kV; LCSC Part Name: 电压:1kV 电流:1A; Supplier Part: C64898; Manufacturer: MDD; Supplier Footprint: SOD-123FL; JLCPCB Part Class: Basic Part; Datasheet: https://atta.szlcsc.com/upload/public/pdf/source/20230823/16A8FDE162764C9B685A3717F2DA3690.pdf; Supplier: LCSC; Diode Configuration: 独立式; Forward Voltage (Vf@If): 1.1V@1A; Reverse Voltage (Vr): 400V; Average Rectified Current (Io): 1A; Reverse Leakage Current: 10uA@1kV
F21 F22 F210 F220 = 5x20 环保 保险管夹/座: FuseholderType:-FuseType:-ForUseWith/RelatedProducts:-FuseSize:-NumberofCircuits:-VoltageRating:-CurrentRating:-MountingType:-ContactMaterial:-ContactFinish:-; LCSC Part Name: 5x20保险管夹/座; Supplier Part: C3130; Manufacturer: xcfuse(旭程); Manufacturer Part: 5x20环保保险管夹/座; Supplier Footprint: 5x20; JLCPCB Part Class: ExtendedPart; Datasheet: https://atta.szlcsc.com/upload/public/pdf/source/20201204/C3130_0BBF31010F20A3F0EEDE0C51B760226B.pdf; Supplier: LCSC
K1-K3 = 973-5VDC-SL-A 15A250VAC: RelayType:GeneralPurposeCoilType:NonLatchingCoilVoltage:5VDCContactForm:SPSTContactRating(Current):15ASwitchingVoltage:(277VAC,110VDC)Max; LCSC Part Name: 功率继电器; Supplier Part: C396951; Manufacturer: NHC(汇龙仓); Manufacturer Part: 973-5VDC-SL-A15A250VAC; Supplier Footprint: 插件; JLCPCB Part Class: ExtendedPart; Datasheet: https://atta.szlcsc.com/upload/public/pdf/source/20190620/C396951_1D25D7C8B8509A9E6050155B4FA2087A.pdf; Supplier: LCSC; Relay Type: GeneralPurpose; Coil Type: NonLatching; Coil Voltage: 5VDC; Contact Form: SPST; Contact Rating (Current): 15A; Switching Voltage: (277VAC,110VDC)Max
L1 = UU10.5Y-10mH: NumberofLines:2Inductance@Frequency:10mH@1kHzDCResistance(DCR):750mΩ; LCSC Part Name: 10mH@1kHz; Supplier Part: C75196; Manufacturer: FH(风华); Supplier Footprint: ThroughHole; JLCPCB Part Class: ExtendedPart; Datasheet: https://atta.szlcsc.com/upload/public/pdf/source/20201015/C75196_9D901360C20AB97143C25AF7B779C5AC.pdf; Supplier: LCSC; Number of Lines: 2; Inductance @ Frequency: 10mH@1kHz; DC Resistance (DCR): 750mΩ
P21-P23 = WJ500V-5.08-3P: Pitch:5.08mm Structure:1x3P Number of Rows:1 Number of PINs Per Row:3 Mounting Style:Straight Current Rating (Max):18A Voltage Rating (Max):250V Wire Gauge - AWG:14~30 Wire Gauge - AWG:14~30 Wire Gauge - mm2:2.5 Wire Gauge - mm2:2.5 Operating Temperature; LCSC Part Name: 5.08mm 1x3P 排数:1 每排P数:3 直插 可拼接; Supplier Part: C72334; Manufacturer: KANGNEX(康奈克斯电气); Supplier Footprint: 插件,P=5.08mm; JLCPCB Part Class: Extended Part; Datasheet: https://atta.szlcsc.com/upload/public/pdf/source/20191225/C72334_8A5EF831D67650233B6B1E3F2BC06274.pdf; Supplier: LCSC; Pitch: 5.08mm; Structure: 1x3P; Number of Rows: 1; Number of PINs Per Row: 3; Mounting Style: Straight; Current Rating (Max): 18A; Voltage Rating (Max): 250V; Wire Gauge - AWG: 14~30; Wire Gauge - mm2: 2.5; Operating Temperature Range: -40℃~+105℃; Color: Green; Number of Pins: 3P; Mounting Sytle: 直针; Wire Gauge - mm?: 2.5
R9 = 10D561K_C113236: Allowable Voltage (AC): Allowable Voltage (DC): Varistor Voltage:504V~616V Varistor Voltage:504V~616V Clamping Voltage: Peak Current: Maximum Energy:42.3J Maximum Energy:42.3J Typical Capatitance:180pF@1kHz; LCSC Part Name: 插件 920V 42.3焦耳; Supplier Part: C113236; Manufacturer: HEL(鸿志); Supplier Footprint: 插件; JLCPCB Part Class: Extended Part; Datasheet: https://atta.szlcsc.com/upload/public/pdf/source/20170525/1495704231014.pdf; Supplier: LCSC; Allowable Voltage (AC): 350V; Allowable Voltage (DC): 460V; Varistor Voltage: 504V~616V; Clamping Voltage: 920V; Peak Current: 2.5kA; Maximum Energy: 42.3J; Typical Capatitance: 180pF@1kHz
U1 = HLK-5M05: ConversionType:AC-DCFunction:降压型IsolatedOrVoltageRegulation:隔离稳压OutputChannel:1InputVoltage(AC):90VAC~265VACInputVoltage(AC):90VAC~265VACInputVoltage(DC):120V~350VInputVoltage(DC):120V~350VOutputVoltage:5VOutputVoltage:5VOutputCurren; LCSC Part Name: Vin=90VAC~265VACVin=120V~350VVout=5V1A; Supplier Part: C209907; Manufacturer: HI-LINK(海凌科); Supplier Footprint: 插件; JLCPCB Part Class: ExtendedPart; Datasheet: https://atta.szlcsc.comnull; Supplier: LCSC; Conversion Type: AC-DC; Function: 降压型; Isolated Or Voltage Regulation: 隔离稳压; Output Channel: 1; Input Voltage(AC): 90VAC~265VAC; Input Voltage(DC): 120V~350V; Output Voltage: 5V; Output Current (Max): 1A; Output Power: 5W; Insulated Voltage: 3kV@AC; Conversion Efficiency: 69%; Feature: 过流保护；短路保护
R41 R42 = 0805W8F2000T5E: Resistance: Tolerance:±1% Tolerance:±1% Power(Watts): Overload Voltage (Max): Temperature Coefficient:±100ppm/℃ Temperature Coefficient:±100ppm/℃ Type:Thick Film Resistors Operating Temperature Range:-55℃~+155℃ Operating Temperature Range:-55℃~+155℃; LCSC Part Name: 200Ω ±1% 125mW 厚膜电阻; Supplier Part: C17540; Manufacturer: UNI-ROYAL(厚声); Supplier Footprint: 0805; JLCPCB Part Class: Basic Part; Datasheet: https://atta.szlcsc.com/upload/public/pdf/source/20200306/C422600_1E6D84923E4A46A82E41ADD87F860B5C.pdf; Supplier: LCSC; Tolerance: ±1%; Temperature Coefficient: ±100ppm/℃; Type: Thick Film Resistors; Operating Temperature Range: -55℃~+155℃
U41 = MAX31865ATP+T: LCSC Part Name: MAX31865ATP; Supplier Part: C118474; Manufacturer: ADI(亚德诺); Supplier Footprint: QFN-20-EP(5x5); JLCPCB Part Class: Extended Part; Datasheet: https://atta.szlcsc.com/upload/public/pdf/source/20170713/C118474_1499918888820816758.pdf; Supplier: LCSC

## Nets
3V3: C13.1 C14.2 C16.1 C24.2 C41.2 C42.2 C61.2 J5.2 P1.1 R1.2 R12.1 R13.2 R61.2 R62.2 U11.2(3V3) U23.2(VOUT) U41.19(DVDD) U41.20(VDD) U61.8(VCC)
GND: C2.1 C3.1 C4.1 C5.2 C13.2 C14.1 C16.2 C22.2 C23.1 C24.1 C41.1 C42.1 C61.1 J5.4 P1.3 P28.1 R43.1 R44.2 SW1.3(C) SW1.4(D) SW2.3(C) SW2.4(D) U1.3(-VO) U11.1(GND) U11.40(GND) U11.41(GND) U23.1(ADJ) U32.8(E) U41.6(FORCE2) U41.10(GND2) U41.15(DGND) U41.16(GND1) U41.21(EP) U61.4(GND) USB1.15(EH) USB1.A1(GND) USB1.A12(GND) USB1.B1(GND) USB1.B12(GND)
VCC: C2.2 C3.2 C4.2 C5.1 C22.1 C23.2 D1.1(C) D2.1(C) D3.1(C) K1.4 K2.4 K3.4 P28.2 P31.1 P32.1 P33.1 U1.4(+VO) U23.3(VIN) U32.9(COM) USB1.A4(VBUS) USB1.A9(VBUS) USB1.B4(VBUS) USB1.B9(VBUS)
RLY1_OUT: D1.2(A) K1.1 U32.16(1C)
RLY2_OUT: D2.2(A) K2.1 U32.15(2C)
RLY3_OUT: D3.2(A) K3.1 U32.14(3C)
U11_EN: J5.1 R1.1 SW2.1(A) SW2.2(B) U11.3(EN)
U11_IO0: J5.6 R13.1 SW1.1(A) SW1.2(B) U11.27(IO0)
U11_IO4: P1.2 R12.2 U11.4(IO4)
U11_IO5: U11.5(IO5) U32.1(1B)
U11_IO6: U11.6(IO6) U32.2(2B)
U11_IO7: U11.7(IO7) U32.3(3B)
U11_IO8: R61.1 U11.12(IO8) U61.5(SDA)
U11_IO9: R62.1 U11.17(IO9) U61.6(SCL)
U11_IO15: U11.8(IO15) U32.4(4B)
U11_IO16: U11.9(IO16) U32.5(5B)
U11_IO17: U11.10(IO17) U32.6(6B)
U11_IO39: U11.32(IO39) U41.14(SDO)
U11_IO40: U11.33(IO40) U41.11(SDI)
U11_IO41: U11.34(IO41) U41.12(SCLK)
U11_IO42: U11.35(IO42) U41.13(#CS)
U11_UART0_RX: J5.5 U11.36(RXD0)
U11_UART0_TX: J5.3 U11.37(TXD0)
U27_USBD+: U11.14(IO20) USB1.A6(DP1) USB1.B6(DP2)
U27_USBD-: U11.13(IO19) USB1.A7(DN1) USB1.B7(DN2)
Net-(C1-1): C1.1 L1.1 P21.1 P22.1 P23.1 P29.2 R9.1
Net-(C1-2): C1.2 F21.1 L1.4 R9.2
Net-(C43-1): C43.1 J41.1 U41.8(RTDIN) U41.9(FORCE-)
Net-(C43-2): C43.2 J41.2 U41.5(FORCE+) U41.7(RTDIN+)
Net-(F22-1): F22.1 K1.2 K2.2 K3.2 P21.3 P22.3 P23.3
Net-(F210-1): F210.1 F220.1 P29.1
Net-(K1-5): K1.5 P21.2
Net-(K2-5): K2.5 P22.2
Net-(K3-5): K3.5 P23.2
Net-(L1-2): L1.2 U1.2(AC)
Net-(L1-3): L1.3 U1.1(AC)
Net-(P31-2): P31.2 U32.13(4C)
Net-(P32-2): P32.2 U32.12(5C)
Net-(P33-2): P33.2 U32.11(6C)
Net-(R41-1): R41.1 U41.1(BIAS) U41.2(REFIN+)
Net-(R41-2): R41.2 R42.2
Net-(R42-1): R42.1 U41.3(REFIN-) U41.4(ISENSOR)
Net-(R43-2): R43.2 USB1.B5(CC2)
Net-(R44-1): R44.1 USB1.A5(CC1)

Not connected (* = marked no-connect by the designer): U11 11(IO18)* 15(IO3)* 16(IO46)* 18(IO10)* 19(IO11)* 20(IO12)* 21(IO13)* 22(IO14)* 23(IO21)* 24(IO47)* 25(IO48)* 26(IO45)* 28(IO35)* 29(IO36)* 30(IO37)* 31(IO38)* 38(IO2)* 39(IO1)*; U32 7(7B)* 10(7C)*; U41 17(N.C)* 18(#DRDY)*; U61 1(NC)* 2(NC)* 3(NC)* 7(NC)*

## Notes on the sheets
sheet 1
- https://www.espressif.com/sites/default/files/documentation/esp32-s3-wroom-1_wroom-1u_datasheet_en.pdf
- Reset
- Download
sheet 2
- R9 has incorrect footprint
- PSU Schematic https://www.hlktech.com/en/Goods-16.html
